# EAGLE schematic imuahrs (EAGLE 6.4)
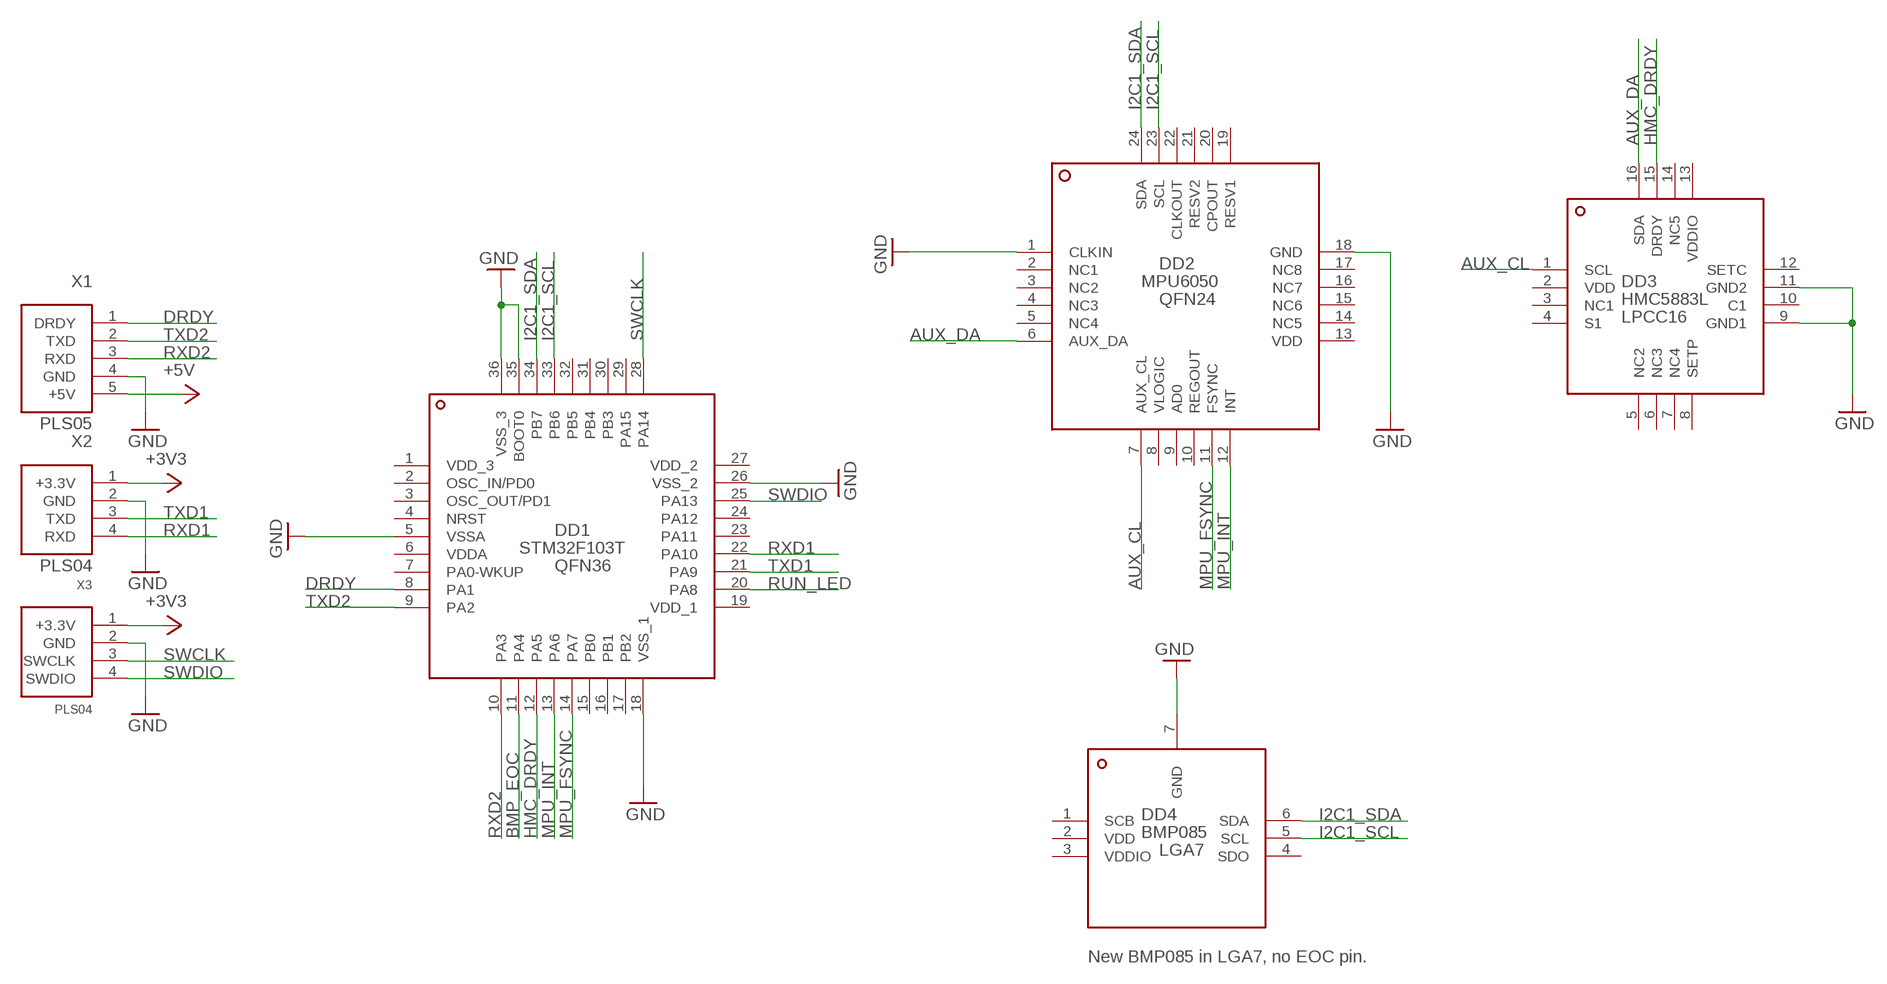
[diagram p0: schematic, sheet 1]

## Parts
DD1  STM32F103T  [QFN36]
DD2  MPU6050  [QFN24-4X4]
DD3  HMC5883  [QFN16-4X4]
DD4  BMP085  [LGA7]
X1  MAIN_CON  [PLS05]
X2  DBG_UART_CON  [PLS04]
X3  DBG_SWD_CON  [PLS04]

## Nets
+3V3: X2.1(+3.3V) X3.1(+3.3V)
+5V: X1.5(+5V)
AUX_CL: DD2.7(AUX_CL) DD3.1(SCL)
AUX_DA: DD2.6(AUX_DA) DD3.16(SDA)
BMP_EOC: DD1.11(PA4)
DRDY: DD1.8(PA1) X1.1(DRDY)
GND: DD1.5(VSSA) DD1.18(VSS_1) DD1.26(VSS_2) DD1.35(BOOT0) DD1.36(VSS_3) DD2.1(CLKIN) DD2.18(GND) DD3.9(GND1) DD3.11(GND2) DD4.7(GND) X1.4(GND) X2.2(GND) X3.2(GND)
HMC_DRDY: DD1.12(PA5) DD3.15(DRDY)
I2C1_SCL: DD1.33(PB6) DD2.23(SCL) DD4.5(SCL)
I2C1_SDA: DD1.34(PB7) DD2.24(SDA) DD4.6(SDA)
MPU_FSYNC: DD1.14(PA7) DD2.11(FSYNC)
MPU_INT: DD1.13(PA6) DD2.12(INT)
RUN_LED: DD1.20(PA8)
RXD1: DD1.22(PA10) X2.4(RXD)
RXD2: DD1.10(PA3) X1.3(RXD)
SWCLK: DD1.28(PA14) X3.3(SWCLK)
SWDIO: DD1.25(PA13) X3.4(SWDIO)
TXD1: DD1.21(PA9) X2.3(TXD)
TXD2: DD1.9(PA2) X1.2(TXD)
Unconnected: DD1.1(VDD_3) DD1.2(OSC_IN/PD0) DD1.3(OSC_OUT/PD1) DD1.4(NRST) DD1.6(VDDA) DD1.7(PA0-WKUP) DD1.15(PB0) DD1.16(PB1) DD1.17(PB2) DD1.19(VDD_1) DD1.23(PA11) DD1.24(PA12) DD1.27(VDD_2) DD1.29(PA15) DD1.30(PB3) DD1.31(PB4) DD1.32(PB5) DD2.2(NC1) DD2.3(NC2) DD2.4(NC3) DD2.5(NC4) DD2.9(AD0) DD2.10(REGOUT) DD2.14(NC5) DD2.15(NC6) DD2.16(NC7) DD2.17(NC8) DD2.19(RESV1) DD2.20(CPOUT) DD2.21(RESV2) DD2.22(CLKOUT) DD3.3(NC1) DD3.4(S1) DD3.5(NC2) DD3.6(NC3) DD3.7(NC4) DD3.8(SETP) DD3.10(C1) DD3.12(SETC) DD3.14(NC5) DD4.1(SCB) DD4.4(SDO)

## Notes on the sheet
- New BMP085 in LGA7, no EOC pin.

## Power pins joined to a net without a drawn wire
VDD: DD2.13(VDD) DD3.2(VDD) DD4.2(VDD)
VDDIO: DD3.13(VDDIO) DD4.3(VDDIO)
VLOGIC: DD2.8(VLOGIC)

## Library data of the parts
DD1 = elem:STM32F103T: Package not werifyed.
DD2 = elem:MPU6050: Package for schematics only.
DD3 = elem:HMC5883: Package just for schematics. Do not use for board.
DD4 = elem:BMP085
X1 = elem:MAIN_CON
X2 = elem:DBG_UART_CON
X3 = elem:DBG_SWD_CON